# Altium project HBridge_GW.PrjPcb
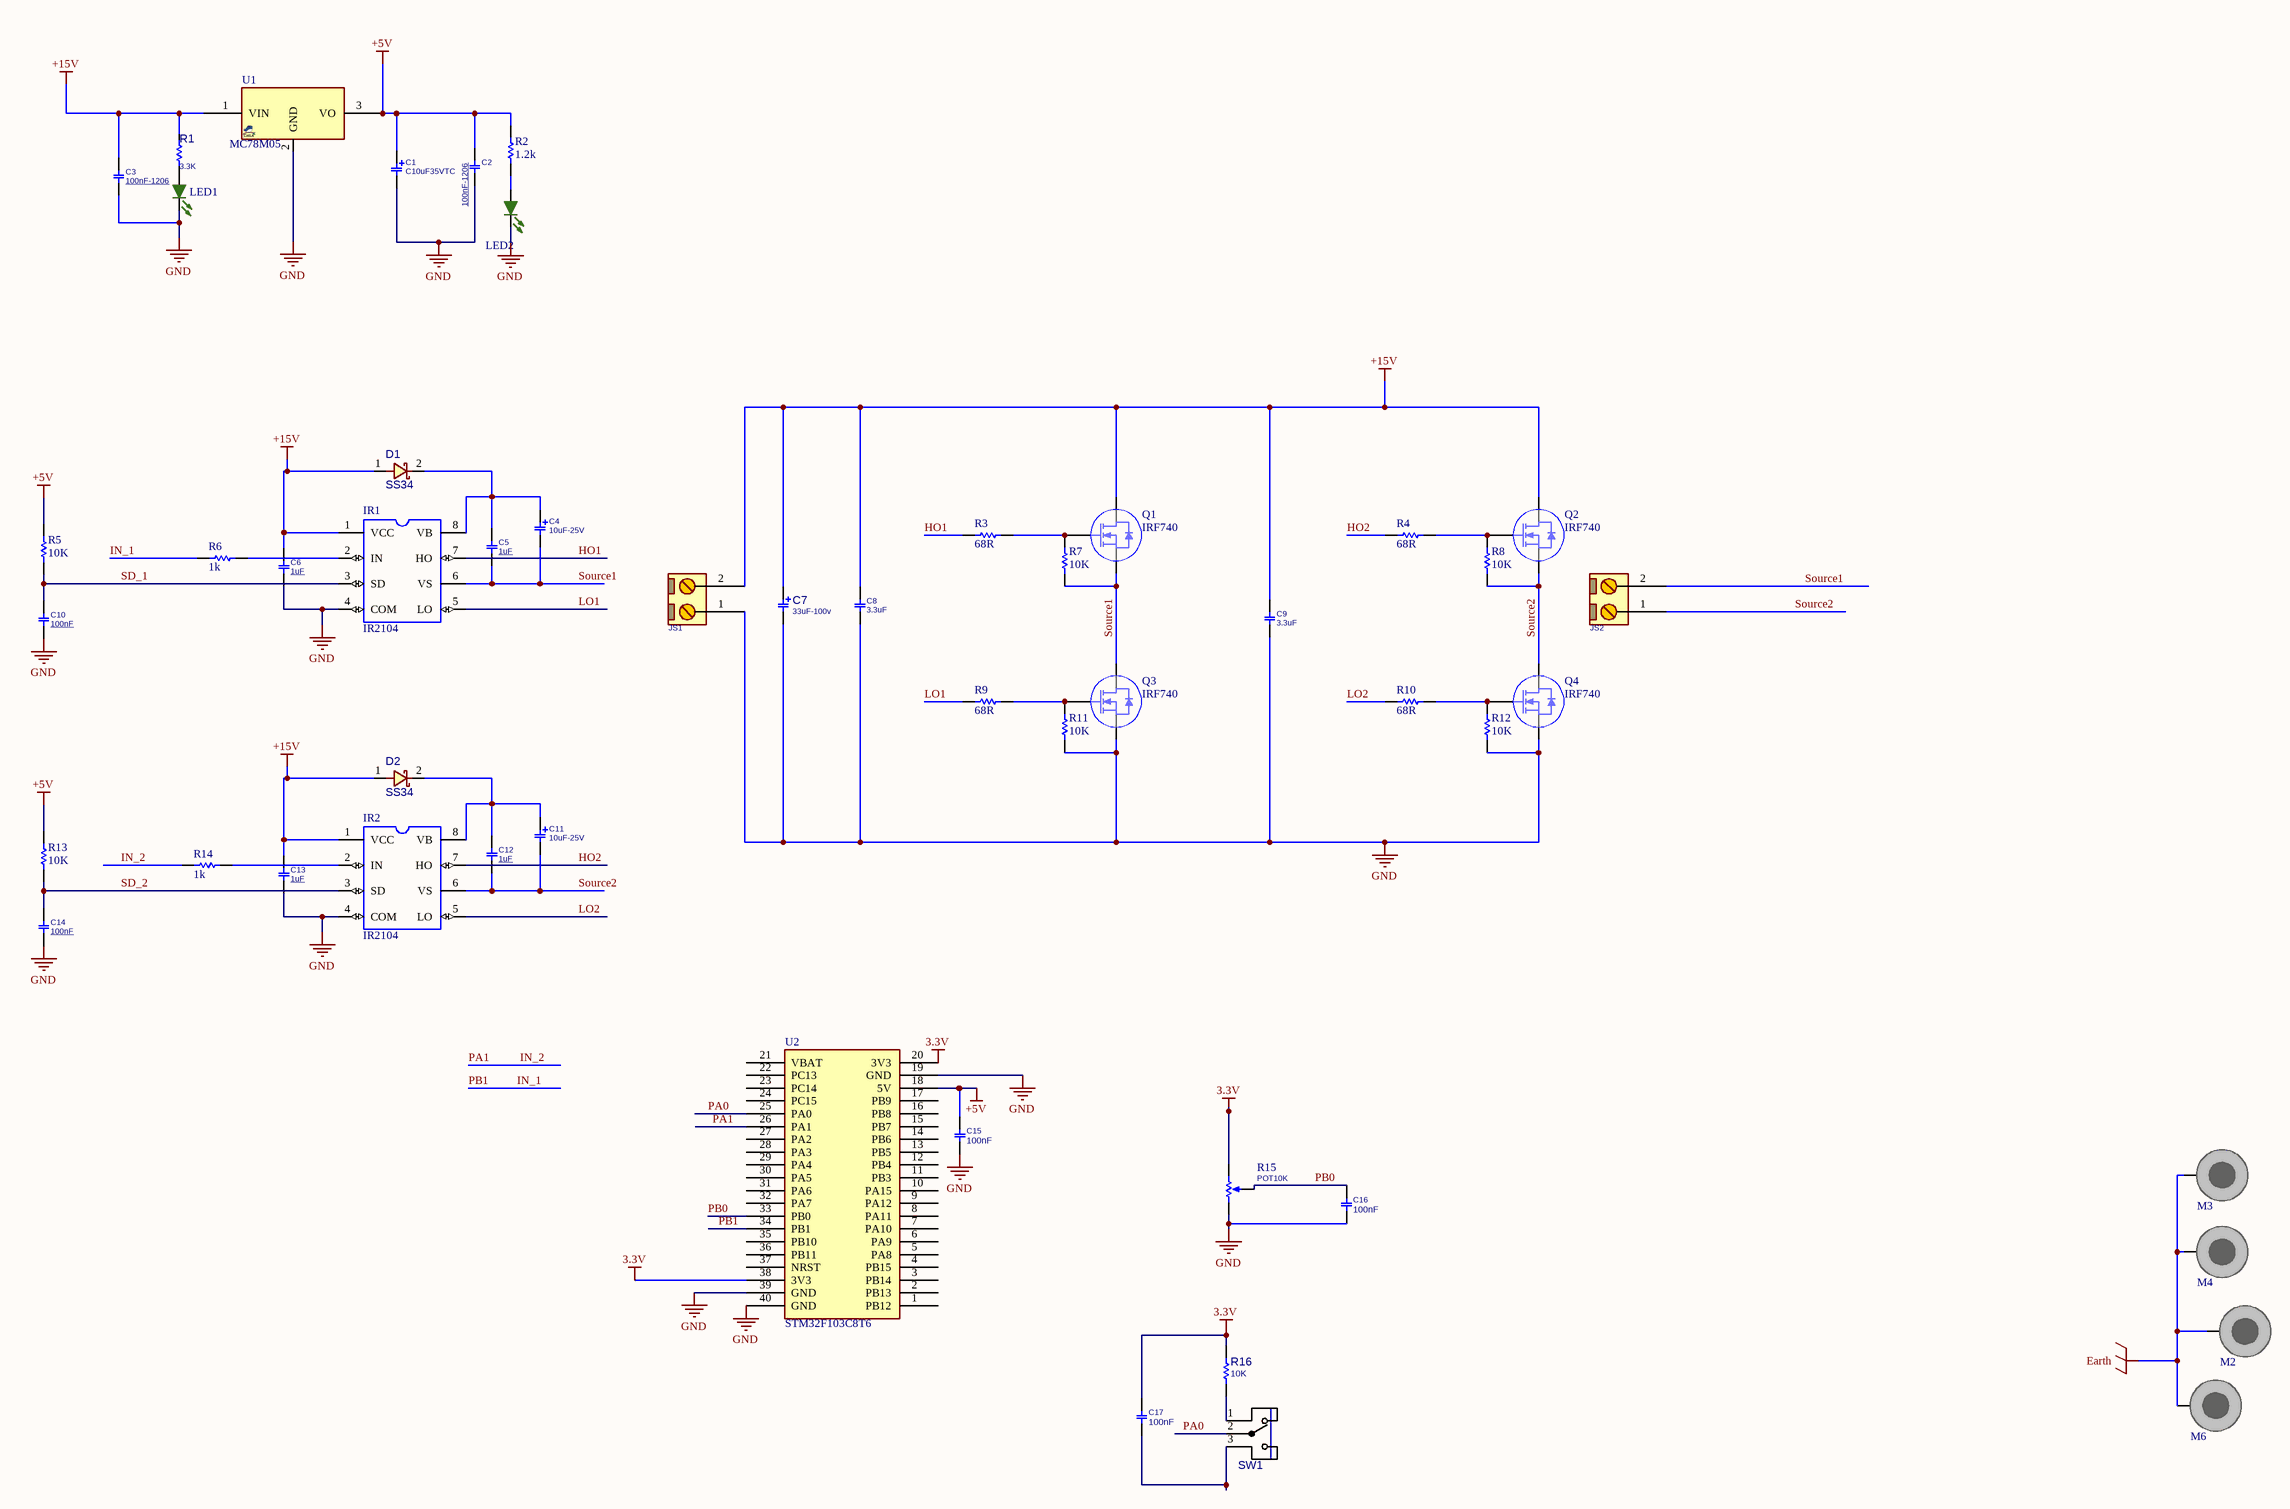
[diagram p0: HBridge_GW.SchDoc]
1 sheet, 52 parts. Net scope: global (net labels, ports and power ports of the same name join across sheets).
Board file: HBridge_GW.PcbDoc

## Sheet HBridge_GW.SchDoc
size A2

### Parts
C1  C10uF35VTC  [C_TN_6032]
C2  100nF-1206  [C1206]
C3  100nF-1206  [C1206]
C4  10uF-25V  [C_TN_3528]
C5  1uF  [C1206]
C6  1uF  [C1206]
C7  33uF-100v  [C_EL_8X12]
C8  3.3uF  [C_PLY_13X5]
C9  3.3uF  [C_PLY_13X5]
C10  100nF  [C1206]
C11  10uF-25V  [C_TN_3528]
C12  1uF  [C1206]
C13  1uF  [C1206]
C14  100nF  [C1206]
C15  100nF  [C1206]
C16  100nF  [C1206]
C17  100nF  [C1206]
D1  SS34  [D_SMB]
D2  SS34  [D_SMB]
IR1  IR2104  [IR2104S]
IR2  IR2104  [IR2104S]
JS1  24V  [MSTB_2]  (value not drawn)
JS2  24V  [MSTB_2]  (value not drawn)
LED1  LED SMD 1206 GREEN  [LED 1206 @]  (value not drawn)
LED2  LED SMD 1206 GREEN  [LED 1206 @]  (value not drawn)
M2  DNP/MH  [SCMH_M3]  (value not drawn)  (no BOM)
M3  DNP/MH  [SCMH_M3]  (value not drawn)  (no BOM)
M4  DNP/MH  [SCMH_M3]  (value not drawn)  (no BOM)
M6  DNP/MH  [SCMH_M3]  (value not drawn)  (no BOM)
Q1  IRF740  [TO-220 AB]
Q2  IRF740  [TO-220 AB]
Q3  IRF740  [TO-220 AB]
Q4  IRF740  [TO-220 AB]
R1  value 3.3K  [RESC4817X04N]  (hidden comment: RES_SMD)
R2  1.2k  [RESC4817X04N]
R3  68R  [RESC4817X04N]
R4  68R  [RESC4817X04N]
R5  10K  [RESC4817X04N]
R6  1k  [RESC4817X04N]
R7  10K  [RESC4817X04N]
R8  10K  [RESC4817X04N]
R9  68R  [RESC4817X04N]
R10  68R  [RESC4817X04N]
R11  10K  [RESC4817X04N]
R12  10K  [RESC4817X04N]
R13  10K  [RESC4817X04N]
R14  1k  [RESC4817X04N]
R15  POT10K  [VOL_R]
R16  10K  [R1206]
SW1  ToggleSwitch  [SWTOG_SPDT_S_7101SY]  (value not drawn)
U1  MC78M05  [TO220_3]
U2  STM32F103C8T6  [Stm32 BluePill]

### Nets
3.3V: C17.1 R15.3(BOT) R16.2 U2.20(3V3) U2.38(3V3)
+5V: C1.1 C2.1 C15.2 R2.1 R5.2 R13.2 U1.3(VO) U2.18(5V)
+15V: C3.1 C6.2 C7.1 C8.2 C9.2 C13.2 D1.1 D2.1 IR1.1(VCC) IR2.1(VCC) JS1.2 Q1.2(D) Q2.2(D) R1.1 U1.1(VIN)
Earth: M2.1 M3.1 M4.1 M6.1
GND: C1.2 C2.2 C3.2 C6.1 C7.2 C8.1 C9.1 C10.1 C13.1 C14.1 C15.1 C16.1 IR1.4(COM) IR2.4(COM) JS1.1 LED1.2(K) LED2.2(K) Q3.3(S) Q4.3(S) R11.1 R12.1 R15.1(TOP) U1.2(GND) U2.19(GND) U2.39(GND) U2.40(GND)
HO1: IR1.7(HO) R3.2
HO2: IR2.7(HO) R4.2
IN_1: R6.2 U2.34(PB1)  [also labelled PB1]
IN_2: R14.2 U2.26(PA1)  [also labelled PA1]
LO1: IR1.5(LO) R9.2
LO2: IR2.5(LO) R10.2
PA0: SW1.2(COM) U2.25(PA0)
PB0: C16.2 R15.2(TAP) U2.33(PB0)
SD_1: C10.2 IR1.3(SD) R5.1
SD_2: C14.2 IR2.3(SD) R13.1
Source1: C4.2 C5.1 IR1.6(VS) JS2.2 Q1.3(S) Q3.2(D) R7.1
Source2: C11.2 C12.1 IR2.6(VS) JS2.1 Q2.3(S) Q4.2(D) R8.1
NetC4_1: C4.1 C5.2 D1.2 IR1.8(VB)
NetC11_1: C11.1 C12.2 D2.2 IR2.8(VB)
NetC17_2: C17.2 SW1.3(T2)
NetIR1_2: IR1.2(IN) R6.1
NetIR2_2: IR2.2(IN) R14.1
NetLED1_1: LED1.1(A) R1.2
NetLED2_1: LED2.1(A) R2.2
NetQ1_1: Q1.1(G) R3.1 R7.2
NetQ2_1: Q2.1(G) R4.1 R8.2
NetQ3_1: Q3.1(G) R9.1 R11.2
NetQ4_1: Q4.1(G) R10.1 R12.2
NetR16_1: R16.1 SW1.1(T1)

Not connected (* = marked no-connect by the designer): U2 1(PB12) 2(PB13) 3(PB14) 4(PB15) 5(PA8) 6(PA9) 7(PA10) 8(PA11) 9(PA12) 10(PA15) 11(PB3) 12(PB4) 13(PB5) 14(PB6) 15(PB7) 16(PB8) 17(PB9) 21(VBAT) 22(PC13) 23(PC14) 24(PC15) 27(PA2) 28(PA3) 29(PA4) 30(PA5) 31(PA6) 32(PA7) 35(PB10) 36(PB11) 37(NRST)

### Library data of the parts
C1 = CAP_SMD_TAN_6032: CAP, SMD, TAN,; PARAM2: -V; VALUE: C10uF35VTC
C2 C3 = CAP_SMD_MLCC_1206: CAP, MLCC, -F, -V, MATERIAL, -%, 0201; PARAM: -, -%; MANF_P#: MANF_PART#; PRICE: 100= 1$; MANF: -; PARAM2: -V; ASSEMBLY: ASSEMBLY; VALUE: 100nF-1206
C4 C11 = CAP_SMD_TAN: CAP, SMD, TAN,; PARAM: 25V; VALUE: 10uF-25V
C5 C6 C10 C12-C14 = CAP_SMD_MLCC: CAP, MLCC, 1nF, 50V, C0G, 10%, 0402; MANF_P#: MANF_PART#; MANF: Murata; PARAM: C0G, 10%; PRICE: 100= 1$; DESC: CAP, MLCC, 1nF, 50V, C0G, 10%, 0402; PARAM2: 50V; ASSEMBLY: ASSEMBLY
  C5 C6 C12 C13: VALUE: 1uF
  C10 C14: VALUE: 100nF
C7 = CAP_THD_EL_330u25V: CAP, THD, ELEC, 330uF, 25V; MANF_P#: EEE-1EA331UP; PARAM2: 20%; MANF: PANASONIC; DESC: DESCRIPTION; DIST#: MOUSER; PRICE: 10= 5$; ASSEMBLY: ASSEMBLY; PARAM: 25V; VALUE: 33uF-100v
C8 C9 = CAP_THD_FILMPLY_10N630V: CAP, FILM, 10nF, 630V; MANF_P#: MANF_PART#; PARAM: 630V; PRICE: 100= 1$; DESC: CAP, FILM,; MANF: MANF; PARAM2: PARAM2; ASSEMBLY: ASSEMBLY; VALUE: 3.3uF
C15-C17 = CAP_SMD_MLCC_1206: CAP, MLCC; PARAM: -, -%; MANF_P#: MANF_PART#; PARAM2: -V; PRICE: 100= 1$; MANF: -; ASSEMBLY: ASSEMBLY; VALUE: 100nF
D1 D2 = DIODE_SMD_SCHOTTKY_SS34: DIODE, SCHOTTKY, 40V, 3A; MANF: VISHAY; DESC: DESCRIPTION; PARAM: 20V; MANF_P#: SS34; ASSEMBLY: ASSEMBLY; PRICE: PRICE; PARAM2: 3A; VALUE: SS34
IR1 IR2 = IR2104S: Half-Bridge Gate Driver IC Non-Inverting; MF: Infineon Technologies; SnapEDA_Link: https://www.snapeda.com/parts/IR2104S/Infineon%20Technologies/view-part/582439/?ref=snap; Package: SO-8 Infineon; MP: IR2104S; Price: None; Value: *; Availability: Unavailable
JS1 JS2 = CONN_MSTB_2: CONN, PHOENIX MSTB, 5-G, 5.08mm pitch; VALUE: CONN_TB2; PARAM2: 320V; PARAM: 12A
LED1 LED2 = LED SMD 1206 GREEN: Code Anbar: h.k; Category: LED
M2-M4 M6 = SCMH_M3: SCREW mouting, M3, 3.0mm diameter and 6.0mm PanHead; ASSEMBLY: DNP; VALUE: DNP/MH
Q1-Q4 = IRF740: MOSFET N-CH 400V 10A TO-220AB; Published: 2017-1-12; DatasheetVersion: 2017-1-12; PackageVersion: 2017-1-12; PackageReference: TO-220AB; Publisher: Abbas Basereh; PackageDescription: MOSFET N-CH 400V 10A TO-220AB; ComponentLink1Description: http://www.digikey.com/products/en/discrete-semiconductor-products/19; ComponentLink1URL: http://www.digikey.com/product-detail/en/vishay-siliconix/IRF740PBF/IRF740PBF-ND/812037; ComponentLink2Description: Datasheet; ComponentLink2URL: http://www.roboeq.ir/files/id/1101/name/IRF740A.pdf
R1 = RES_SMD: RESISTOR, SMD; Designer: ahmadi; Category: RESISTOR; Package: 1206; Name: *; Code Anbar: *; Mounting Technology: smd; Voltage: *
R2-R14 = RES 1206 0.25W: RES 1206; Designer: Abbas Basereh; Desc.: RES SMD 1206; Data: 16-12-2016
R15 = RES_THD_POT_VOLUME: RESISTOR, THD, Potentiometer Volume; VALUE: POT10K
R16 = RES_SMD_1206: RESISTOR, SMD; PARAM: 1%, 0.25W; DESC: DESCRIPTION; DIST#: MOUSER; MANF_P#: -; MANF: -; ASSEMBLY: ASSEMBLY; PRICE: -; PARAM2: -; VALUE: 10K
SW1 = SWTOG_SPDT_S_7101SY: SWITCH, TOGGLE, SPDT, THD; MANF_PART#: 7101SYZBE; MANF: C&K; PARAM: 20VAC, 5A; DESC: DESCRIPTION; VALUE: ToggleSwitch; ASSEMBLY: ASSEMBLY; PRICE: 4.5$
U1 = VREG_78M05_TO220: REG, Linear, Fixed, 5v, 1.5A, TO-220; MANF_P#: LM78M05CT, LM7805CT, LM7805ACT, UA7805CKC, L7805ABV, L7805ACV, L7805CV, L78M05CV, KA78T05, KA7805ETU, MC78M05BT, MC78M05CT, MC7805ACT, MC7805ABT, NCP7805TG, NJM7805FA, TS7805CZ; MANF: TI, ST, FAIRCHILD, ON, NJR, TS; PARAM: 5v, 1.5A; PARAM2: PARAM2; VALUE: MC78M05
U2 = BluePill: Designed By @Alixahedi